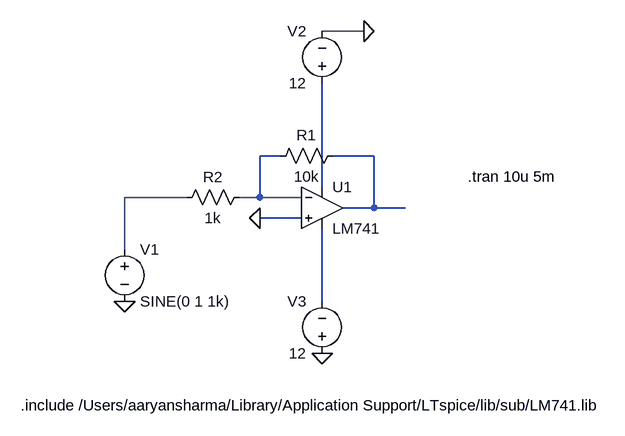
[diagram p0: schematic invertingStage.asc]
invertingStage.asc, the LTspice schematic file:
Version 4
SHEET 1 888 680
WIRE 496 48 432 48
WIRE 368 240 336 240
WIRE 512 240 448 240
WIRE 432 288 432 128
WIRE 224 304 128 304
WIRE 336 304 336 240
WIRE 336 304 304 304
WIRE 400 304 336 304
WIRE 512 320 512 240
WIRE 512 320 464 320
WIRE 560 320 512 320
WIRE 400 336 336 336
WIRE 128 384 128 304
WIRE 432 464 432 352
FLAG 336 336 0
FLAG 128 464 0
FLAG 432 544 0
FLAG 496 48 0
SYMBOL OpAmps/opamp2 432 256 R0
SYMATTR InstName U1
SYMATTR Value LM741
SYMBOL res 464 224 R90
WINDOW 0 0 56 VBottom 2
WINDOW 3 32 56 VTop 2
SYMATTR InstName R1
SYMATTR Value 10k
SYMBOL res 320 288 R90
WINDOW 0 0 56 VBottom 2
WINDOW 3 32 56 VTop 2
SYMATTR InstName R2
SYMATTR Value 1k
SYMBOL voltage 128 368 R0
SYMATTR InstName V1
SYMATTR Value SINE(0 1 1k)
SYMBOL voltage 432 144 R180
WINDOW 0 24 96 Left 2
WINDOW 3 24 16 Left 2
SYMATTR InstName V2
SYMATTR Value 12
SYMBOL voltage 432 560 R180
WINDOW 0 24 96 Left 2
WINDOW 3 24 16 Left 2
SYMATTR InstName V3
SYMATTR Value 12
TEXT 656 272 Left 2 !.tran 10u 5m
TEXT -32 624 Left 2 !.include /Users/aaryansharma/Library/Application Support/LTspice/lib/sub/LM741.lib

The netlist it stands for:
* invertingStage.asc
XU1 0 N001 N003 N005 N002 LM741  ; pins In+ In- V+ V- OUT
R1 N002 N001 10k
R2 N001 N004 1k
V1 N004 0 SINE(0 1 1k)
V2 N003 0 12
V3 0 N005 12
.tran 10u 5m
.include /Users/aaryansharma/Library/Application Support/LTspice/lib/sub/LM741.lib
.backanno
.end